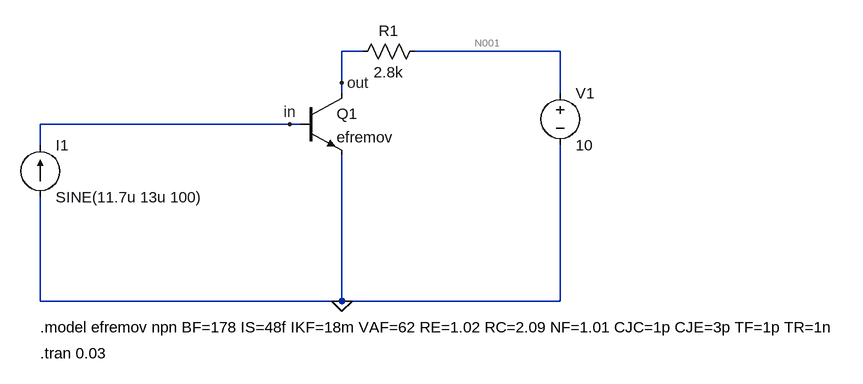
[diagram p0: schematic 2.asc]
2.asc, the LTspice schematic file:
Version 4
SHEET 1 1164 680
WIRE 240 48 208 48
WIRE 544 48 320 48
WIRE 208 96 208 48
WIRE 208 112 208 96
WIRE 544 112 544 48
WIRE 128 160 -256 160
WIRE 144 160 128 160
WIRE -256 192 -256 160
WIRE -256 432 -256 272
WIRE 208 432 208 208
WIRE 208 432 -256 432
WIRE 544 432 544 192
WIRE 544 432 208 432
FLAG 208 432 0
FLAG 208 96 out
FLAG 128 160 in
SYMBOL npn 144 112 R0
SYMATTR InstName Q1
SYMATTR Value efremov
SYMBOL voltage 544 96 R0
WINDOW 123 0 0 Left 2
WINDOW 39 0 0 Left 2
SYMATTR InstName V1
SYMATTR Value 10
SYMBOL current -256 272 M180
WINDOW 0 24 80 Left 2
WINDOW 3 24 0 Left 2
WINDOW 123 0 0 Left 2
WINDOW 39 0 0 Left 2
SYMATTR InstName I1
SYMATTR Value SINE(11.7u 13u 100)
SYMBOL res 336 32 R90
WINDOW 0 0 56 VBottom 2
WINDOW 3 32 56 VTop 2
SYMATTR InstName R1
SYMATTR Value 2.8k
TEXT -256 472 Left 2 !.model efremov npn BF=178 IS=48f IKF=18m VAF=62 RE=1.02 RC=2.09 NF=1.01 CJC=1p CJE=3p TF=1p TR=1n
TEXT -256 512 Left 2 !.tran 0.03

The netlist it stands for:
* 2.asc
Q1 out in 0 0 efremov
V1 N001 0 10
I1 0 in SINE(11.7u 13u 100)
R1 N001 out 2.8k
.model NPN NPN
.model PNP PNP
.lib standard.bjt
.model efremov npn BF=178 IS=48f IKF=18m VAF=62 RE=1.02 RC=2.09 NF=1.01 CJC=1p CJE=3p TF=1p TR=1n
.tran 0.03
.backanno
.end

* Results of the author's LTspice run, read from the files saved beside the schematic
* Operating Point, zero values left out:
*   V(out) = 4.402 V
*   V(in) = 641.9 mV
*   V(n001) = 10 V
*   Ic(Q1) = 1.999 mA
*   Ib(Q1) = 11.7 µA
*   Ie(Q1) = -2.011 mA
*   I(I1) = 11.7 µA
*   I(R1) = 1.999 mA
*   I(V1) = -1.999 mA
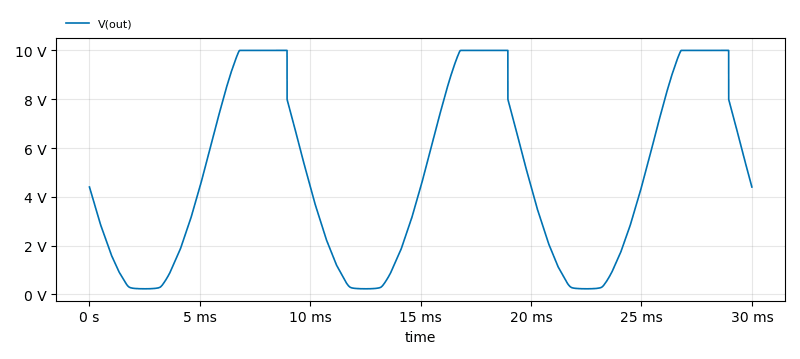
[diagram p1: Transient Analysis of 2.asc, plotted from the saved traces]
* Transient Analysis, 1 run:
*   V(out): min 231 mV, max 10 V, average 4.893 V, rms 6.177 V, last 4.402 V